# Altium schematic sheet LoraBoard.SchDoc
size A3
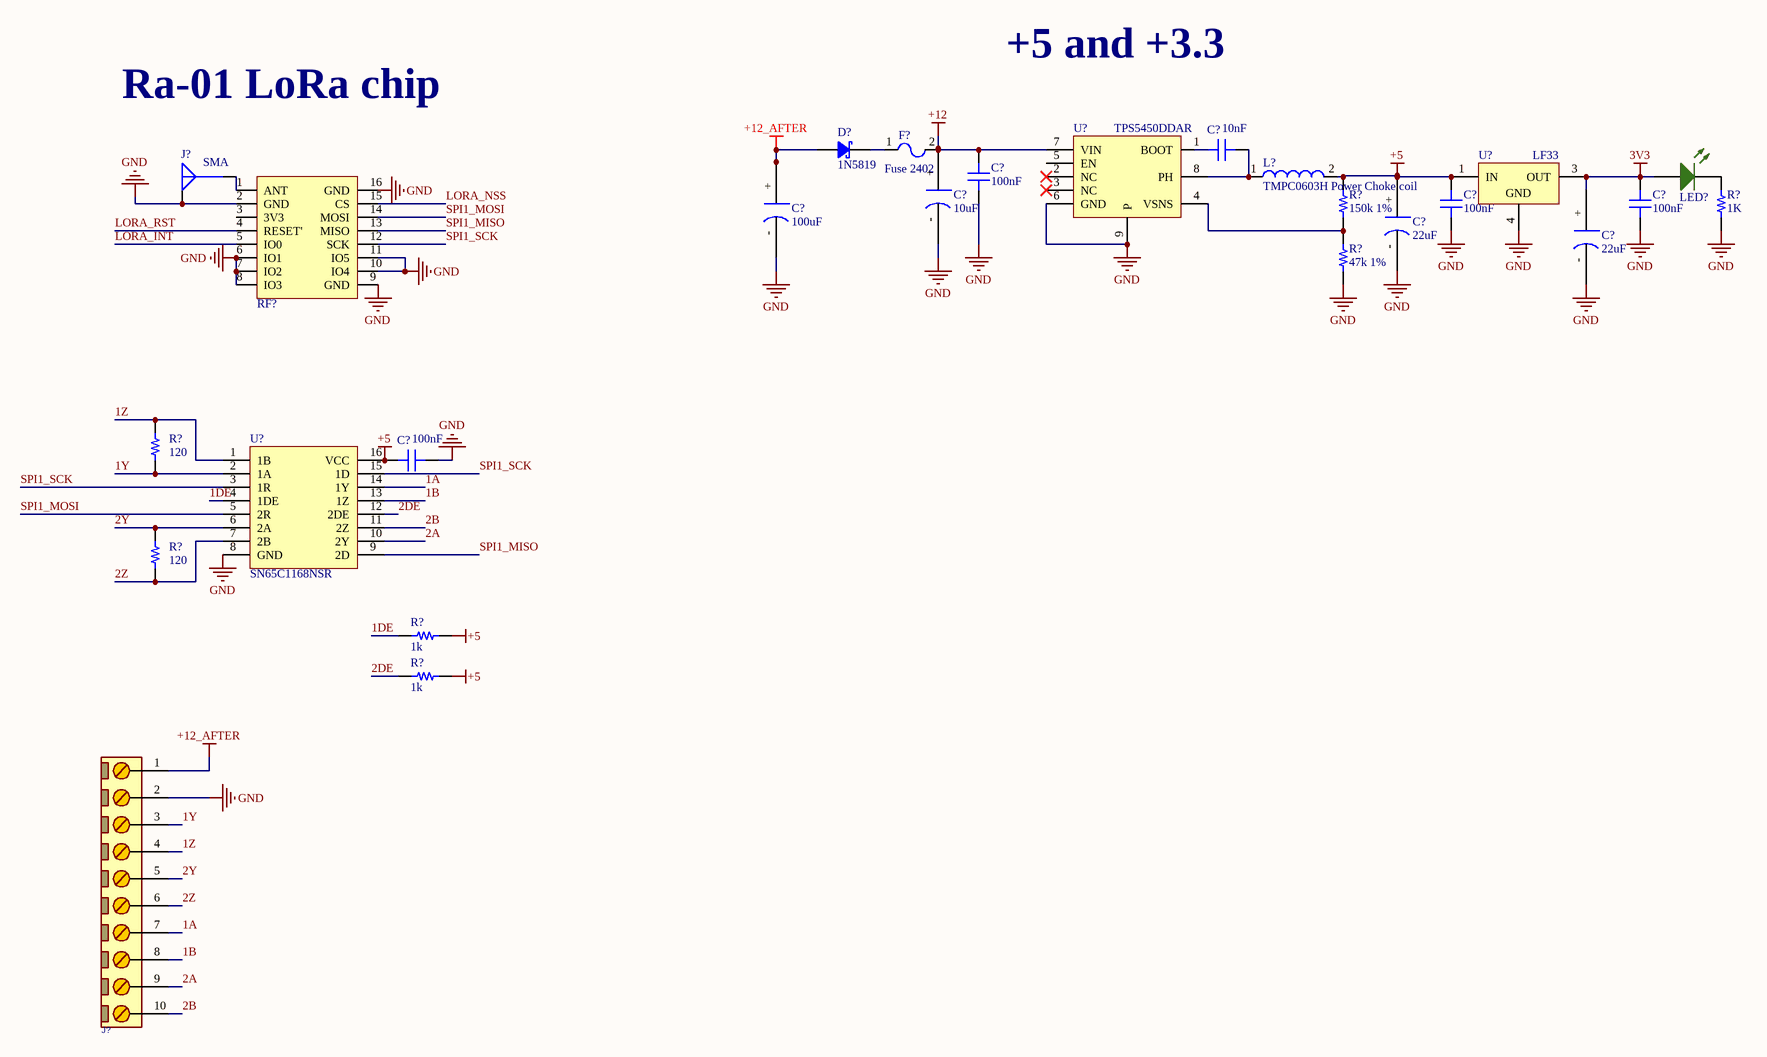
[diagram p0: LoraBoard.SchDoc]

## Parts
(Parts that share a designator on the sheet are numbered #1, #2 ... from top to bottom, then left to right.)
C?#1  10nF  [CAP 0805_2012]
C?#2  100nF  [CAP 0805_2012]
C?#3  10uF  [CAP_6.3x7.7]
C?#4  100nF  [CAP 0805_2012]
C?#5  100nF  [CAP 0805_2012]
C?#6  100uF  [CAP_6.3x7.7]
C?#7  22uF  [CAP_6.3x7.7]
C?#8  22uF  [CAP_6.3x7.7]
C?#9  100nF  [CAP 0805_2012]
D?  1N5819  [SOD-123]
F?  Fuse 2402  [2402]
J?#1  SMA  [MOLEX SD-73100-0114]
J?#2  Phoenix MSTB 10Pin  [PHOENIX MSTB_10]  (value not drawn)
L?  TMPC0603H Power Choke coil  [6.3coil]
LED?  LED SMD 0805 GREEN  [LED_0805_GREEN]  (value not drawn)
R?#1  150k 1%  [RES 0805_2012]
R?#2  1K  [RES 0805_2012]
R?#3  47k 1%  [RES 0805_2012]
R?#4  120  [RES 0805_2012]
R?#5  120  [RES 0805_2012]
R?#6  1k  [RES 0805_2012]
R?#7  1k  [RES 0805_2012]
RF?  Lora-Ra-01  [LORA-RA-01]  (value not drawn)
U?#1  LF33  [TO-252]
U?#2  TPS5450DDAR  [PDSO-G8]
U?#3  SN65C1168NSR  [SOP16]

## Nets
3V3: C?#5.2 C?#8.+ LED?.1(A) U?#1.3(OUT)
+5: C?#4.2 C?#7.+ C?#9.2 L?.2 R?#1.2 R?#6.2 R?#7.2 U?#1.1(IN) U?#3.16(VCC)
+12: C?#2.2 C?#3.+ F?.2 U?#2.7(VIN)
+12_AFTER: C?#6.+ D?.1 J?#2.1
GND: C?#2.1 C?#3.- C?#4.1 C?#5.1 C?#6.- C?#7.- C?#8.- C?#9.1 J?#1.G J?#2.2 R?#2.1 R?#3.1 RF?.2(GND) RF?.6(IO1) RF?.7(IO2) RF?.8(IO3) RF?.9(GND) RF?.10(IO4) RF?.11(IO5) RF?.16(GND) U?#1.4(GND) U?#2.6(GND) U?#2.9(P) U?#3.8(GND)
1A: J?#2.7 U?#3.14(1Y)
1B: J?#2.8 U?#3.13(1Z)
1DE: R?#6.1 U?#3.4(1DE)
1Y: J?#2.3 R?#4.2 U?#3.2(1A)
1Z: J?#2.4 R?#4.1 U?#3.1(1B)
2A: J?#2.9 U?#3.10(2Y)
2B: J?#2.10 U?#3.11(2Z)
2DE: R?#7.1 U?#3.12(2DE)
2Y: J?#2.5 R?#5.1 U?#3.6(2A)
2Z: J?#2.6 R?#5.2 U?#3.7(2B)
LORA_INT: RF?.5(IO0)
LORA_NSS: RF?.15(CS)
LORA_RST: RF?.4(RESET')
SPI1_MISO: RF?.13(MISO) U?#3.9(2D)
SPI1_MOSI: RF?.14(MOSI) U?#3.5(2R)
SPI1_SCK: RF?.12(SCK) U?#3.3(1R) U?#3.15(1D)
NetC?#1_1: C?#1.1 L?.1 U?#2.8(PH)
NetC?#1_2: C?#1.2 U?#2.1(BOOT)
NetD?_2: D?.2 F?.1
NetJ?#1_S: J?#1.S RF?.1(ANT)
NetLED?_2: LED?.2(K) R?#2.2
NetR?#1_1: R?#1.1 R?#3.2 U?#2.4(VSNS)

Not connected (* = marked no-connect by the designer): RF? 3(3V3); U?#2 2(NC)* 3(NC)* 5(EN)

## Notes on the sheet
- Ra-01 LoRa chip
- +5 and +3.3

## Library data of the parts
C?#1 = Cap 0805: SMT Capacitor; VALUE: 100nF
C?#2 C?#4 C?#5 C?#9 = Cap 0805: SMT Capacitor; VALUE: 100nF
C?#3 C?#6-C?#8 = Cap Alu 6.3x7.7mm: SMD Aluminum Capacitor 6.3x7.7mm
D? = 1N5819 (SMD): Diode Schottky 40V 1A Surface Mount SOD-123  Speed Fast Recovery =< 500ns, > 200mA (Io); PartNumber: 1N5819HW-7-F
J?#1 = SMA-RA MOLEX SD-73100-0114 (THD): PartNumber: MOLEX SD-73100-0114
J?#2 = Phoenix MSTB 10Pin: CONN, PHOENIX MSTB, 5-G, 5.08mm pitch; PartNumber: MSTB 2,5/10-G-5,08 - 1759091
R?#1 R?#3-R?#5 = Res 0805: SMT Resistor; VALUE: 1K
R?#2 R?#6 R?#7 = Res 0805: SMT Resistor; VALUE: 1K
U?#1 = LF33 (SMD): 500mA, Very Low Drop (0.45V) Voltage Regulator, 3.3V, 3-Pin DPAK, Tape and Reel; PartNumber: LF33CDT-TR; DatasheetVersion: Nov-2010; PackageVersion: 2011; PackageReference: TO-252; PackageDescription: 3-Pin Transistor Outline Package 2.28 mm Pitch, 9.7 mm Lead Span (DPAK); ComponentLink1Description: Manufacturer URL; ComponentLink1URL: http://www.st.com; ComponentLink2Description: Datasheet; ComponentLink2URL: http://www.st.com/internet/com/TECHNICAL_RESOURCES/TECHNICAL_LITERATURE/DATASHEET/CD00000546.pdf
U?#2 = TPS5450DDAR: Buck Switching Regulator IC Positive Adjustable 1.221V 1 Output 5A 8-PowerSOIC (0.154, 3.90mm Width); Manufacturer: Texas Instruments; Output Voltage: 31V; Switching Frequency: 500kHz; Efficiency: 90%; Min Input Voltage: 5.5V; Number of Outputs: 1; Max Input Voltage: 36V; Synchronous Rectifier: No; Min Output Voltage: 1.22V; Quiescent Current: 3mA; Supplier 1: Digi-Key; Manufacturer Part Number: TPS5450DDAR; RoHS: Yes; Category: Voltage Regulators - Switching; Stock 1: 16111; Pricing 1: 1=5.44000, 10=4.88400, 25=4.61720, 100=4.00170, 250=3.79648, 500=3.40658, 1000=3.09760 (USD); Mount: Surface Mount; Case/Package: HSOP; Number of Pins: 8; Weight: 0.00249oz; Min Operating Temperature: -40°C; Max Operating Temperature: 125°C; Package Quantity: 2500; Output Current: 5A; Series: SWIFT™; Packaging: Tape and Reel; Max Output Current: 5A; Max Output Voltage: 31V; Operating Supply Voltage: 36V; Output Type: Adjustable; Length: 5mm; Width: 4mm; Height: 1.55mm; Radiation Hardening: No; Lead Free: Lead Free; RoHS Compliant: Yes; ComponentLink1URL: https://datasheet.ciiva.com/15113/getdatasheetpartid-172659-15113657.pdf?src-supplier=Verical; ComponentLink1Description: https://datasheet.ciiva.com/15113/getdatasheetpartid-172659-15113657.pdf?src-supplier=Verical; ComponentLink2URL: https://datasheet.ciiva.com/2035/tps5450-2035367.pdf?src-supplier=Digi-Key; ComponentLink2Description: https://datasheet.ciiva.com/2035/tps5450-2035367.pdf?src-supplier=Digi-Key; ComponentLink3URL: https://datasheet.ciiva.com/2035/tps5450-2035366.pdf?src-supplier=Digi-Key; ComponentLink3Description: https://datasheet.ciiva.com/2035/tps5450-2035366.pdf?src-supplier=Digi-Key; ComponentLink4URL: https://datasheet.ciiva.com/2035/tps5450-2035368.pdf?src-supplier=Digi-Key; ComponentLink4Description: https://datasheet.ciiva.com/2035/tps5450-2035368.pdf?src-supplier=Digi-Key; ComponentLink5URL: https://datasheet.ciiva.com/14303/tps5450-14303689.pdf?src-supplier=Avnet; ComponentLink5Description: https://datasheet.ciiva.com/14303/tps5450-14303689.pdf?src-supplier=Avnet; ComponentLink6URL: https://datasheet.ciiva.com/3220/tps5450-3220230.pdf?src-supplier=Avnet; ComponentLink6Description: https://datasheet.ciiva.com/3220/tps5450-3220230.pdf?src-supplier=Avnet; Supplier Part Number 1: 296-26997-1-ND
U?#3 = SN65C1168NSR: SN65C1168 Dual Differential Dri; Manufacturer: Texas Instruments; Number of Receivers: 2; Operating Supply Voltage: 5V; Min Supply Voltage: 4.5V; Max Supply Voltage: 5.5V; Nominal Supply Current: 9mA; Data Rate: 10Mbps; Logic Function: Transceiver,Receiver; Number of Transceivers: 1; Simplex/Duplex: Full Duplex; ESD Protection: No; Supplier 1: Digi-Key; Manufacturer Part Number: SN65C1168NSR; RoHS: Yes; Category: Interface ICs; Pricing 1: 1=3.24000, 10=2.90600, 25=2.74760, 100=2.38120, 250=2.25908, 500=2.02706, 1000=1.72800 (USD); Case/Package: SOP; Number of Pins: 16; Weight: 0.007079oz; Contact Plating: Gold; Min Operating Temperature: -40°C; Max Operating Temperature: 85°C; Number of Transmitters: 2; Packaging: Tape and Reel; Package Quantity: 2000; Number of Drivers: 2; Series: -; Supply Current: 9mA; Operating Supply Current: 9mA; Max Supply Current: 9mA; Lead Free: Lead Free; RoHS Compliant: Yes; ComponentLink1URL: https://datasheet.ciiva.com/6636/sn65c1168-6636522.pdf?src-supplier=Digi-Key; ComponentLink1Description: https://datasheet.ciiva.com/6636/sn65c1168-6636522.pdf?src-supplier=Digi-Key; ComponentLink2URL: https://datasheet.ciiva.com/6636/sn65c1168-6636521.pdf?src-supplier=Digi-Key; ComponentLink2Description: https://datasheet.ciiva.com/6636/sn65c1168-6636521.pdf?src-supplier=Digi-Key; ComponentLink3URL: https://datasheet.ciiva.com/6636/sn65c1168-6636523.pdf?src-supplier=Digi-Key; ComponentLink3Description: https://datasheet.ciiva.com/6636/sn65c1168-6636523.pdf?src-supplier=Digi-Key; ComponentLink4URL: https://datasheet.ciiva.com/14426/slls159f-14426415.pdf?src-supplier=Avnet; ComponentLink4Description: https://datasheet.ciiva.com/14426/slls159f-14426415.pdf?src-supplier=Avnet; Supplier Part Number 1: 296-31716-6-ND